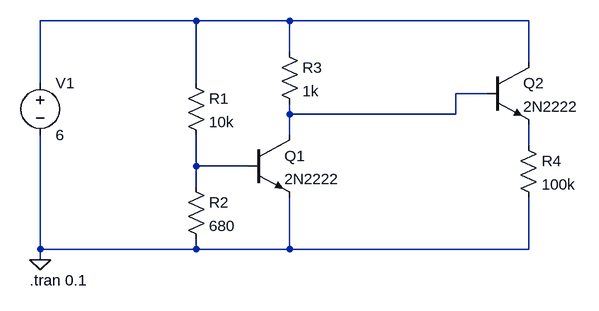
[diagram p0: schematic Circuit test.asc]
Circuit test.asc, the LTspice schematic file:
Version 4
SHEET 1 1220 680
WIRE 544 128 304 128
WIRE 688 128 544 128
WIRE 1056 128 688 128
WIRE 688 176 688 128
WIRE 1056 192 1056 128
WIRE 304 224 304 128
WIRE 544 224 544 128
WIRE 992 240 944 240
WIRE 688 272 688 256
WIRE 944 272 944 240
WIRE 944 272 688 272
WIRE 688 304 688 272
WIRE 1056 320 1056 288
WIRE 544 352 544 304
WIRE 624 352 544 352
WIRE 544 384 544 352
WIRE 304 480 304 304
WIRE 544 480 544 464
WIRE 544 480 304 480
WIRE 688 480 688 400
WIRE 688 480 544 480
WIRE 1056 480 1056 400
WIRE 1056 480 688 480
WIRE 304 496 304 480
FLAG 304 496 0
SYMBOL voltage 304 208 R0
SYMATTR InstName V1
SYMATTR Value 6
SYMBOL res 528 208 R0
SYMATTR InstName R1
SYMATTR Value 10k
SYMBOL res 528 368 R0
SYMATTR InstName R2
SYMATTR Value 680
SYMBOL res 672 160 R0
SYMATTR InstName R3
SYMATTR Value 1k
SYMBOL npn 624 304 R0
SYMATTR InstName Q1
SYMATTR Value 2N2222
SYMBOL npn 992 192 R0
SYMATTR InstName Q2
SYMATTR Value 2N2222
SYMBOL res 1040 304 R0
SYMATTR InstName R4
SYMATTR Value 100k
TEXT 288 528 Left 2 !.tran 0.1

The netlist it stands for:
* Circuit test.asc
V1 N001 0 6
R1 N001 N004 10k
R2 N004 0 680
R3 N001 N002 1k
Q1 N002 N004 0 0 2N2222
Q2 N001 N002 N003 0 2N2222
R4 N003 0 100k
.model NPN NPN
.model PNP PNP
.lib standard.bjt
.tran 0.1
.backanno
.end